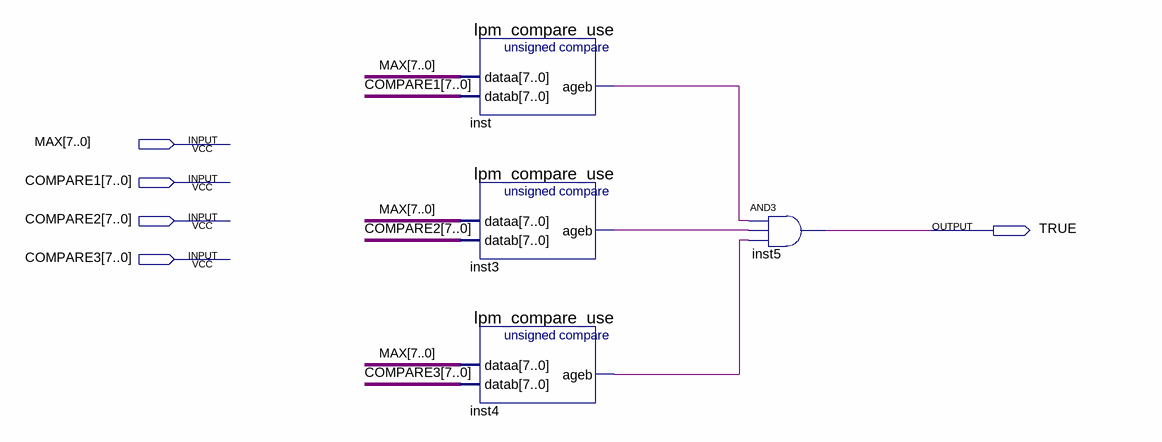
[diagram p0: schematic sheet]
// Quartus schematic isMAXtheLargest.bdf as structural Verilog: 4 symbols, 5 pins
module isMAXtheLargest (
  input  [7:0] MAX,
  input  [7:0] COMPARE1,
  input  [7:0] COMPARE2,
  input  [7:0] COMPARE3,
  output TRUE
);

  wire inst3_ageb, inst4_ageb, inst_ageb;

  lpm_compare_use inst (.dataa(MAX), .datab(COMPARE1), .ageb(inst_ageb));
  lpm_compare_use inst3 (.dataa(MAX), .datab(COMPARE2), .ageb(inst3_ageb));
  lpm_compare_use inst4 (.dataa(MAX), .datab(COMPARE3), .ageb(inst4_ageb));
  and inst5 (TRUE, inst_ageb, inst3_ageb, inst4_ageb);
endmodule
